# EAGLE design TFT Touch (EAGLE 6.1)
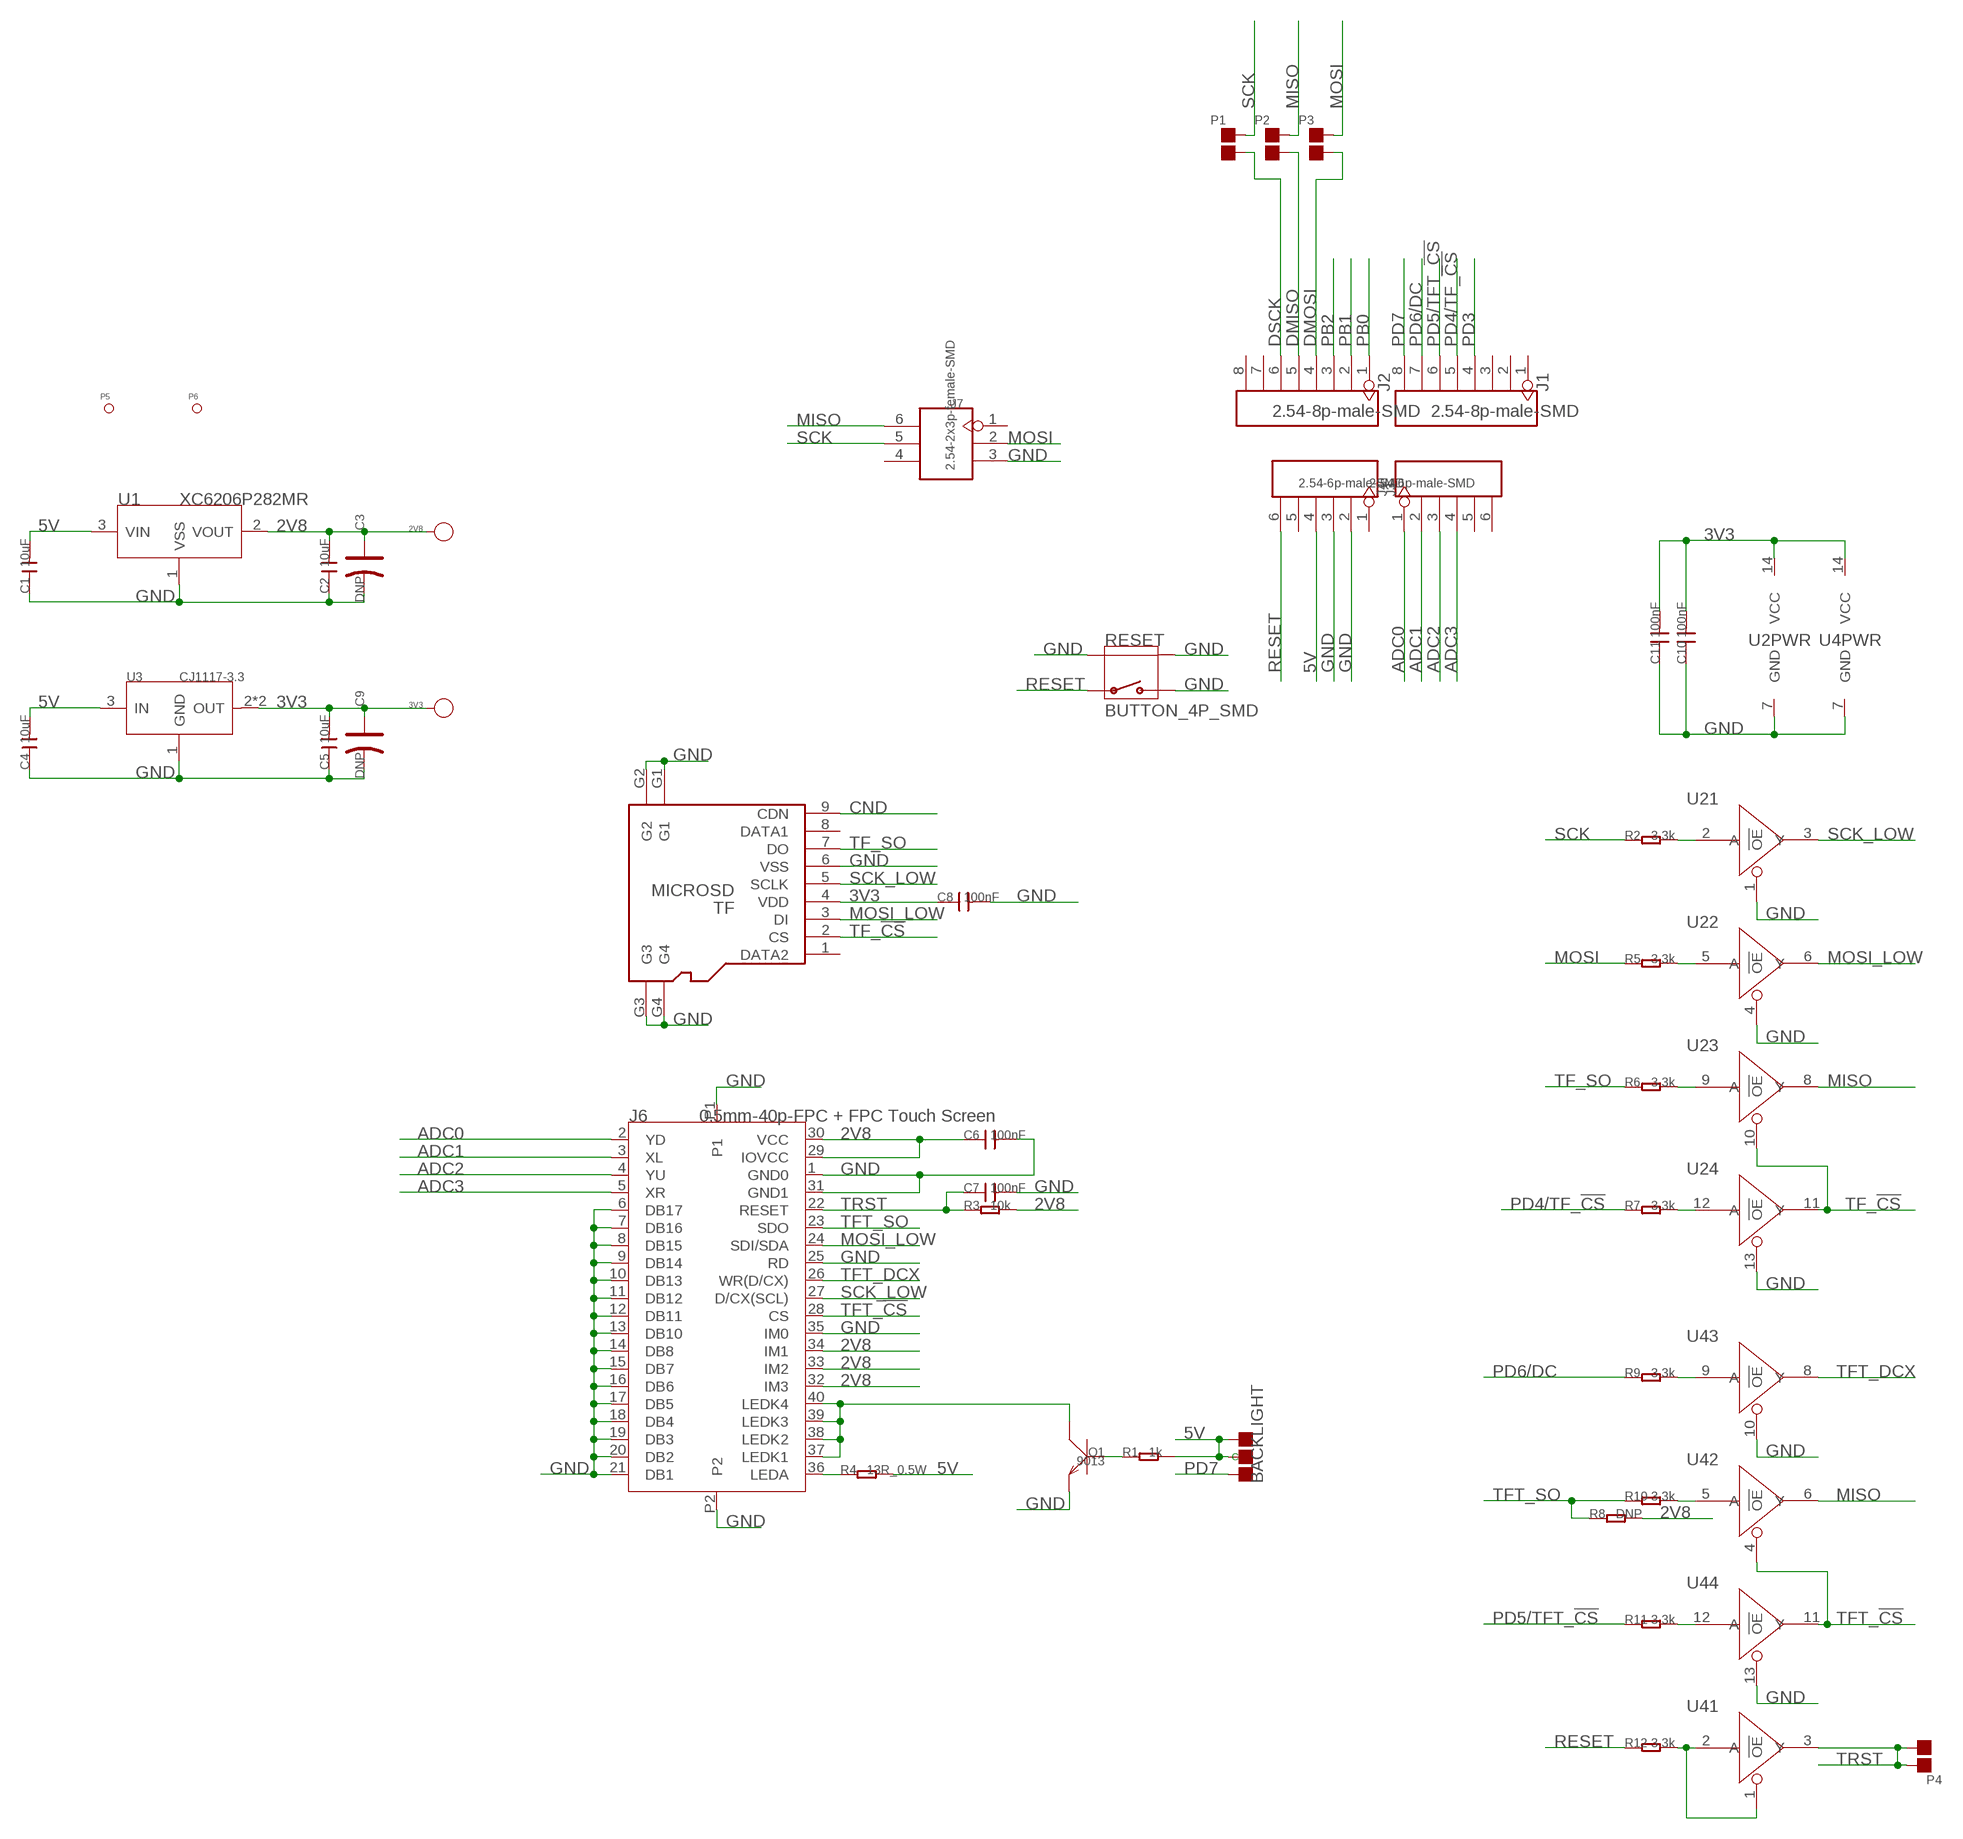
[diagram p0: schematic, sheet 1]

## Parts
2V8  PAD-TEST-POINT-CIRCLE'4545'  [TP_4545]
3V3  PAD-TEST-POINT-CIRCLE'4545'  [TP_4545]
BACKLIGHT  DNP  PAD-JUMPER-3P-40*40  [3P-SMD-4.1X1.5]
C1  10uF  C-0805  [C0805]
C2  10uF  C-0805  [C0805]
C3  DNP  CAP-AVX-A  [AVX-A]
C4  10uF  C-0805  [C0805]
C5  10uF  C-0805  [C0805]
C6  100nF  006-C35*40  [0603@1]
C7  100nF  006-C35*40  [0603@1]
C8  100nF  006-C35*40  [0603@1]
C9  DNP  CAP-AVX-A  [AVX-A]
C10  100nF  006-C35*40  [0603@1]
C11  100nF  006-C35*40  [0603@1]
J1  2.54-8p-male-SMD  HEADER-8P-2.54-SMD  [8P-2.54-SMD]
J2  2.54-8p-male-SMD  HEADER-8P-2.54-SMD  [8P-2.54-SMD]
J3  2.54-6p-male-SMD  HEADER-6P-SMD  [6P-2.54-SMD]
J4  2.54-6p-male-SMD  HEADER-6P-SMD  [6P-2.54-SMD]
J6  0.5mm-40p-FPC + FPC Touch Screen  2.8TFT_FPC  [2.8TFT_FFC]
J7  2.54-2x3p-female-SMD  HEADER-2X3P-SMD  [2X3P-2.54-SMD]
P1  PAD-JUMPER-2P  [2P-SMD-1.78X1.27]
P2  PAD-JUMPER-2P  [2P-SMD-1.78X1.27]
P3  PAD-JUMPER-2P  [2P-SMD-1.78X1.27]
P4  PAD-JUMPER-2P  [2P-SMD-1.78X1.27]
P5  PAD-MARK  [ROUND-MARK-1.0]
P6  PAD-MARK  [ROUND-MARK-1.0]
Q1  9013  TRANSISTOR-NPN-SOT23  [SOT23]
R1  1k  R-0603  [R0603]
R2  3.3k  R-0603  [R0603]
R3  10k  R-0603  [R0603]
R4  13R_0.5W  R-1206  [R1206]
R5  3.3k  R-0603  [R0603]
R6  3.3k  R-0603  [R0603]
R7  3.3k  R-0603  [R0603]
R8  DNP  R-0603  [R0603]
R9  3.3k  R-0603  [R0603]
R10  3.3k  R-0603  [R0603]
R11  3.3k  R-0603  [R0603]
R12  3.3k  R-0603  [R0603]
RESET  BUTTON_4P_SMD  [4P-SMD-7X3.5X3.5]
TF  MICROSD  [MICROSD]
U1  XC6206P282MR  XC6206MR  [SOT23]
U2  74VHC125PW  [TSSOP14]
U3  CJ1117-3.3  LD1117S  [SOT-223]
U4  74VHC125PW  [TSSOP14]

## Nets
2V8: 2V8.T C2.2 C3.+ C6.1 J6.29(IOVCC) J6.30(VCC) J6.32(IM3) J6.33(IM2) J6.34(IM1) R3.2 R8.2 U1.2(VOUT)
3V3: 3V3.T C5.2 C8.1 C9.+ C10.2 C11.2 TF.4(VDD) U2.14(PWR:VCC) U3.2(OUT) U3.TER(OUT) U4.14(PWR:VCC)
5V: BACKLIGHT.00(L) BACKLIGHT.MM(C) C1.2 C4.2 J4.4 R1.2 R4.2 U1.3(VIN) U3.3(IN)
ADC0: J3.1 J6.2(YD)
ADC1: J3.2 J6.3(XL)
ADC2: J3.3 J6.4(YU)
ADC3: J3.4 J6.5(XR)
CND: TF.9(CDN)
DMISO: J2.5 P2.1
DMOSI: J2.4 P3.1
DSCK: J2.6 P1.1
GND: C1.1 C2.1 C3.- C4.1 C5.1 C6.2 C7.2 C8.2 C9.- C10.1 C11.1 J4.2 J4.3 J6.1(GND0) J6.6(DB17) J6.7(DB16) J6.8(DB15) J6.9(DB14) J6.10(DB13) J6.11(DB12) J6.12(DB11) J6.13(DB10) J6.14(DB8) J6.15(DB7) J6.16(DB6) J6.17(DB5) J6.18(DB4) J6.19(DB3) J6.20(DB2) J6.21(DB1) J6.25(RD) J6.31(GND1) J6.35(IM0) J6.P1 J6.P2 J7.3 Q1.2(E) RESET.2 RESET.S1 RESET.S2 TF.6(VSS) TF.G1 TF.G2 TF.G3 TF.G4 U1.1(VSS) U2.1(1:!OE) U2.4(2:!OE) U2.7(PWR:GND) U2.13(4:!OE) U3.1(GND) U4.7(PWR:GND) U4.10(3:!OE) U4.13(4:!OE)
MISO: J7.6 P2.2 U2.8(3:Y) U4.6(2:Y)
MOSI: J7.2 P3.2 R5.1
MOSI_LOW: J6.24(SDI/SDA) TF.3(DI) U2.6(2:Y)
N$2: R2.2 U2.2(1:A)
N$3: Q1.1(B) R1.1
N$4: J6.37(LEDK1) J6.38(LEDK2) J6.39(LEDK3) J6.40(LEDK4) Q1.3(C)
N$5: R5.2 U2.5(2:A)
N$6: R6.2 U2.9(3:A)
N$7: R11.2 U4.12(4:A)
N$8: R10.2 U4.5(2:A)
N$9: J6.36(LEDA) R4.1
N$10: R9.2 U4.9(3:A)
N$15: R7.2 U2.12(4:A)
PB0: J2.1
PB1: J2.2
PB2: J2.3
PD3: J1.4
PD4/TF_!CS: J1.5 R7.1
PD5/TFT_!CS: J1.6 R11.1
PD6/DC: J1.7 R9.1
PD7: BACKLIGHT.11(R) J1.8
RESET: J4.6 R12.1 RESET.1
SCK: J7.5 P1.2 R2.1
SCK_LOW: J6.27(D/CX(SCL)) TF.5(SCLK) U2.3(1:Y)
TF_!CS: TF.2(CS) U2.10(3:!OE) U2.11(4:Y)
TF_SO: R6.1 TF.7(DO)
TFT_!CS: J6.28(CS) U4.4(2:!OE) U4.11(4:Y)
TFT_BUF: R12.2 U4.1(1:!OE) U4.2(1:A)
TFT_DCX: J6.26(WR(D/CX)) U4.8(3:Y)
TFT_SO: J6.23(SDO) R8.1 R10.1
TRST: C7.1 J6.22(RESET) P4.1 P4.2 R3.1 U4.3(1:Y)
Unconnected: J1.1 J1.2 J1.3 J2.7 J2.8 J3.5 J3.6 J4.1 J4.5 J7.1 J7.4 TF.1(DATA2) TF.8(DATA1)

## Library data of the parts
2V8 3V3 = Discrete:PAD-TEST-POINT-CIRCLE; PARTNO: DNP
BACKLIGHT = Discrete:PAD-JUMPER-3P; PARTNO: DNP
C1 C2 C4 C5 = Discrete:C*: Ceramic Capacitors
C3 C9 = Discrete:CAP*: Electrolytic Capacitors,Tantalum Capacitors and Super Capacitors
C6-C8 C10 C11 = Discrete:006-C*: Ceramic Capacitors
J1 J2 = Connector:HEADER-8P
J3 J4 = Connector:HEADER-6P
J6 = For_Test_Albert_v6:2.8TFT_FPC
J7 = Connector:HEADER-2X3P
P1-P4 = Discrete:PAD-JUMPER-2P; PARTNO: DNP
P5 P6 = Discrete:PAD-MARK; PARTNO: DNP
Q1 = Discrete:TRANSISTOR-NPN*: NPN audion
R1-R12 = Discrete:R*
RESET = For_Test_Albert_v6:BUTTON_4P_SMD: TS-1188E http://www.best-dz.com/?thread-374-2.html
TF = SD_TF_holder:MICROSD
U1 = IC:XC6206: LOW ESR Cap.Compatible Positive Voltage Regulators
U2 U4 = template:74V*125: Quad Buffer/Line Driver;3-state
U3 = IC:LD1117: Low Drop Fixed And Adjustable Positive Voltage Regulators http://www.datasheetcatalog.org/datasheet/SGSThomsonMicroelectronics/mXuqtqv.pdf

## Net classes
0 default: width 0.152 mm, drill 0.305 mm, clearance 0.152 mm

## Board
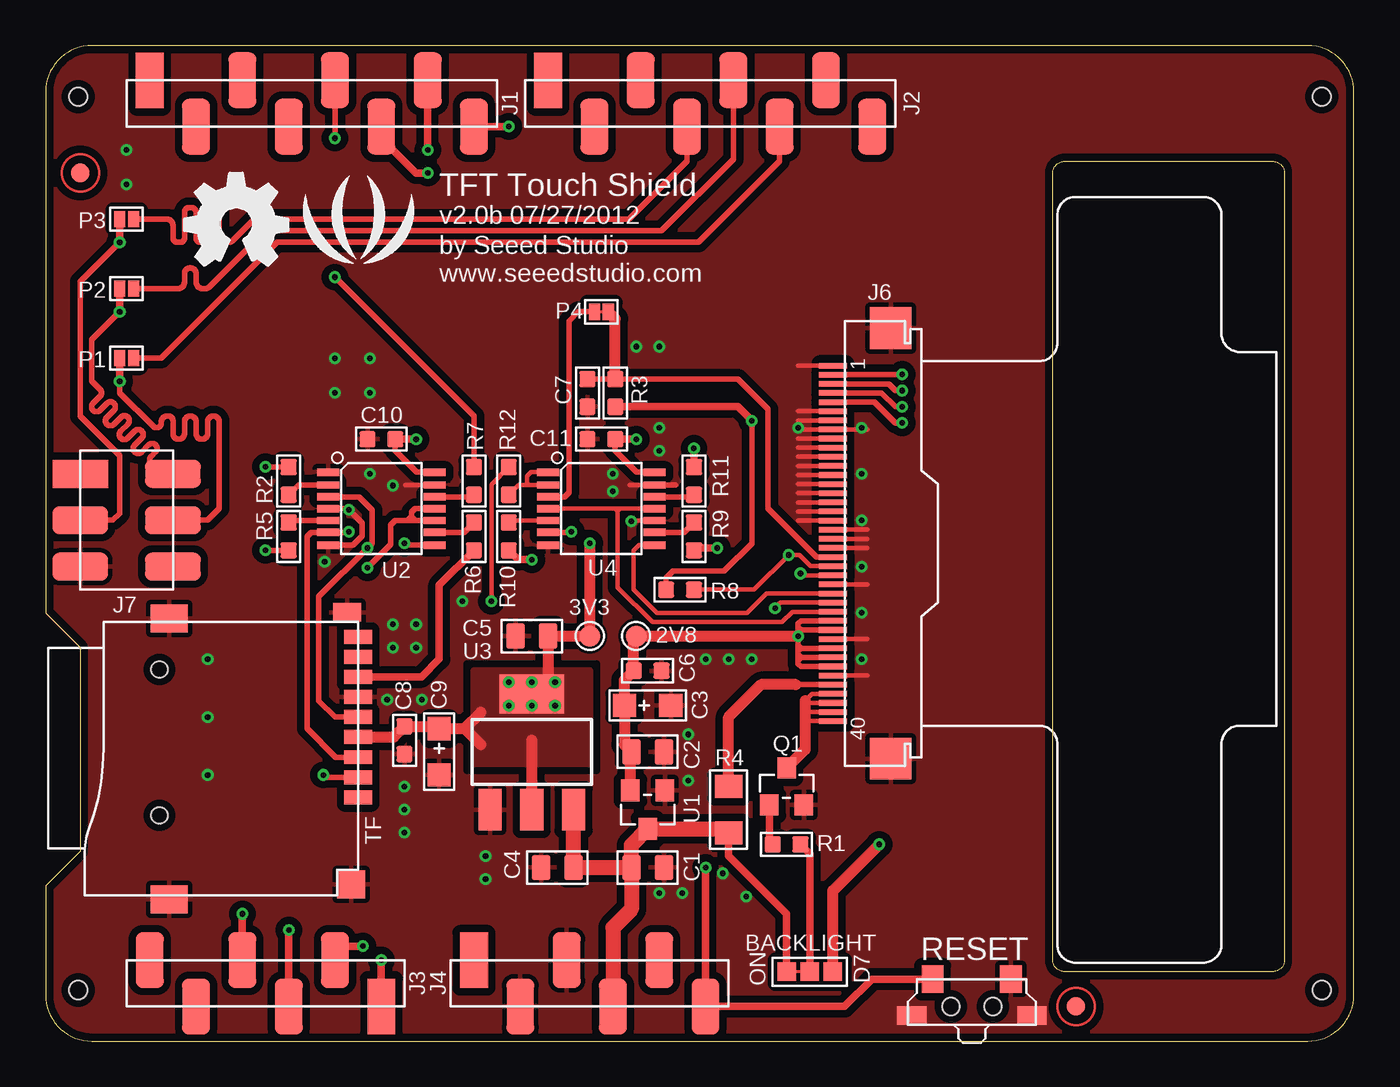
[diagram p1: board, top side]
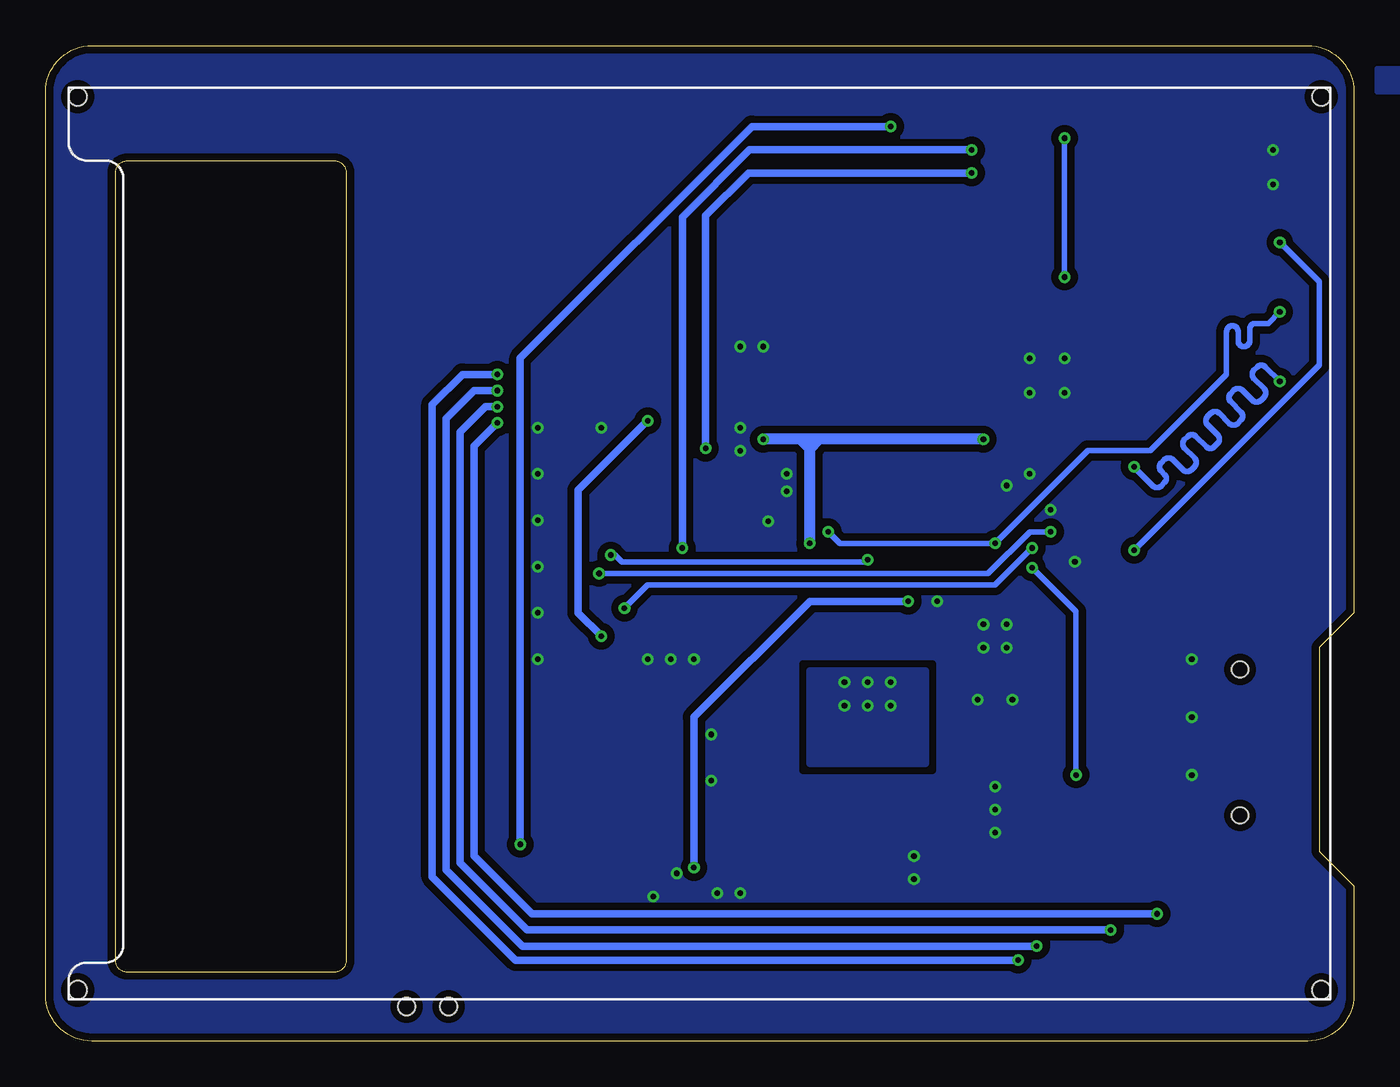
[diagram p2: board, bottom side, seen from below]

Size 71.75 x 54.61 mm. Coordinates in mm from the lower left corner, seen from the top.
Outline: 71.75,52.07 arc90 69.22,54.61 2.54,54.61 arc90 0,52.07 0,23.5 1.91,21.59 1.91,10.41 0,8.51 0,2.54 arc90 2.54,0 69.22,0 arc90 71.75,2.54 71.75,52.07
Outline: 55.88,48.26 67.31,48.26 arc-90 67.94,47.62 67.94,4.45 arc-90 67.31,3.81 55.88,3.81 arc-90 55.25,4.45 55.25,47.62 arc-90 55.88,48.26
Copper layers (1*16): Top 0.035mm / dielectric 1.5mm / Bottom 0.035mm
Design rules: minimum track width 6mil, minimum drill 12mil, track to track 6mil, track to pad 6mil, pad to pad 6mil, via to via 8mil, smd to smd 0mil, copper to edge 10mil, drill to drill 10mil, minimum pad ring 10mil, minimum via ring 6mil, stop-mask expansion 2mil, vias tented up to drill 25mil, thermal gap 10mil
tRestrict: area 42.4,17.4 to 43.9,37.2
Milling: area 55.2,3.8 to 67.9,48.3

### Footprints (pad centres in the part's own frame; a part is rotated, then mirrored left to right if it is on the bottom)
TP_4545 = smd 1.143 x 1.143: T 0,0
3P-SMD-4.1X1.5 = smd 1.016 x 1.016: 00 -1.27,0; 11 1.27,0; MM 0,0
C0805 = smd 1.016 x 1.397: 1 -0.889,0; 2 0.889,0
AVX-A = smd 1.27 x 1.27: + -1.27,0; - 1.27,0
0603@1 = smd 0.889 x 0.889: 1 -0.762,0; 2 0.762,0
8P-2.54-SMD = smd 3.048 x 1.524: 1 1.27,8.89; 2 -1.27,6.35; 3 1.27,3.81; 4 -1.27,1.27; 5 1.27,-1.27; 6 -1.27,-3.81; 7 1.27,-6.35; 8 -1.27,-8.89
6P-2.54-SMD = smd 3.048 x 1.524: 1 1.27,6.35; 2 -1.27,3.81; 3 1.27,1.27; 4 -1.27,-1.27; 5 1.27,-3.81; 6 -1.27,-6.35
2.8TFT_FFC = smd 0.305 x 1.524 bottom: 1 -9.75,3.81; 2 -9.25,3.81; 3 -8.75,3.81; 4 -8.25,3.81; 5 -7.75,3.81; 6 -7.25,3.81; 7 -6.75,3.81; 8 -6.25,3.81; 9 -5.75,3.81; 10 -5.25,3.81; 11 -4.75,3.81; 12 -4.25,3.81; 13 -3.75,3.81; 14 -3.25,3.81; 15 -2.75,3.81; 16 -2.25,3.81; 17 -1.75,3.81; 18 -1.25,3.81; 19 -0.75,3.81; 20 -0.25,3.81; 21 0.25,3.81; 22 0.75,3.81; 23 1.25,3.81; 24 1.75,3.81; 25 2.25,3.81; 26 2.75,3.81; 27 3.25,3.81; 28 3.75,3.81; 29 4.25,3.81; 30 4.75,3.81; 31 5.25,3.81; 32 5.75,3.81; 33 6.25,3.81; 34 6.75,3.81; 35 7.25,3.81; 36 7.75,3.81; 37 8.25,3.81; 38 8.75,3.81; 39 9.25,3.81; 40 9.75,3.81 | smd 2.286 x 2.286 bottom: P1 -11.811,0.635; P2 11.811,0.635 | hole 1: -24.5,45.2; -24.5,-23; 24.5,-23; 24.5,45.2
2X3P-2.54-SMD = smd 3.048 x 1.524: 1 -2.54,2.54; 2 -2.54,0; 3 -2.54,-2.54; 4 2.54,-2.54; 5 2.54,0; 6 2.54,2.54
2P-SMD-1.78X1.27 = smd 0.889 x 0.61: 1 0,0.381; 2 0,-0.381
ROUND-MARK-1.0 = smd 1.016 x 1.016: P$1 0,0
SOT23 = smd 1.016 x 1.143: 1 -0.95,-1.016; 2 0.95,-1.016; 3 0,1.016
R0603 = smd 0.889 x 0.889: 1 -0.762,0; 2 0.762,0
R1206 = smd 1.27 x 1.524: 1 -1.27,0; 2 1.27,0
4P-SMD-7X3.5X3.5 = smd 1.2 x 1.5: 1 -2.15,1.5; 2 2.15,1.5 | smd 1.6 x 1: S1 -3.3,-0.5; S2 3.3,-0.5 | hole 0.95: -1.15,0; 1.15,0
MICROSD = smd 1.524 x 0.762: 1 0,4.4; 2 0,3.3; 3 0,2.2; 4 0,1.1; 5 0,0; 6 0,-1.1; 7 0,-2.2; 8 0,-3.3; 9 0,-4.4 | smd 1.524 x 1.016: G1 0.6,-5.746 | smd 2.032 x 1.524: G2 10.373,-5.4; G3 10.373,10 | smd 1.524 x 1.524: G4 0.392,9.181 | hole 0.889: 10.9,-2.6; 10.9,5.4
SOT23' = smd 1.016 x 1.2: 1 -0.95,-1.06; 2 0.95,-1.06; 3 0,1.06
TSSOP14 = smd 0.4 x 1.2: 1 -2,-2.925; 2 -1.3,-2.925; 3 -0.65,-2.925; 4 0,-2.925; 5 0.65,-2.925; 6 1.3,-2.925; 7 2,-2.925; 8 2,2.925; 9 1.3,2.925; 10 0.65,2.925; 11 0,2.925; 12 -0.65,2.925; 13 -1.3,2.925; 14 -2,2.925
SOT-223 = smd 1.27 x 2.286: 1 -2.286,-3.175; 2 0,-3.175; 3 2.286,-3.175 | smd 3.556 x 2.159: TER 0,3.175

### Placement (x,y rotation side)
2V8  32.39,22.23 0 top
3V3  29.85,22.23 0 top
BACKLIGHT  41.91,3.81 0 top
C1  33.02,9.52 180 top
C2  33.02,15.88 180 top
C3  33.02,18.41 0 top
C4  28.07,9.52 0 top
C5  26.67,22.23 0 top
C6  33.02,20.32 0 top
C7  29.72,35.56 270 top
C8  19.69,16.51 270 top
C9  21.59,15.88 270 top
C10  18.42,33.02 0 top
C11  30.48,33.02 0 top
J1  14.61,51.44 90 top
J2  36.45,51.44 90 top
J3  12.07,3.18 270 top
J4  29.85,3.18 90 top
J6  46.99,27.3 270 bottom
J7  4.45,28.57 0 top
P1  4.45,37.47 270 top
P2  4.45,41.27 270 top
P3  4.45,45.09 270 top
P4  30.48,40 90 top
P5  56.52,1.91 0 top
P6  1.91,47.62 0 top
Q1  40.64,13.97 0 top
R1  40.64,10.79 0 top
R2  13.34,30.73 270 top
R3  31.24,35.56 270 top
R4  37.47,12.7 270 top
R5  13.34,27.69 90 top
R6  23.5,27.69 90 top
R7  23.5,30.73 270 top
R8  34.8,24.77 180 top
R9  35.56,27.69 90 top
R10  25.4,27.69 90 top
R11  35.56,30.73 270 top
R12  25.4,30.73 270 top
RESET  50.8,1.91 0 top
TF  17.15,17.78 180 top
U1  XC6206P282MR  [SOT23']  33.02,12.7 180 top
U2  18.42,29.21 270 top
U3  26.67,15.88 0 top
U4  30.48,29.21 270 top
U$1  [OSHW_FILLX200_NOTEXT]  7.62,42.55 0 top
U$2  [LOGO_SILK]  17.15,44.32 0 top

### Tracks (layer width: path | path; a pad name or v marks a point on that pad's centre or on a via)
2V8  (via drill 0.3 pad 0.64)
  Top 0.305: J6.34 41.42,20.55 41.28,20.7 41.28,20.89 | 41.28,21.08 41.28,21.21 | 41.28,21.21 41.28,21.4 | 41.28,21.4 41.28,21.59 | 41.28,21.59 41.28,21.72 | 41.28,21.72 v41.28,22.23 | 41.28,22.42 41.28,22.73 | 41.28,22.73 41.28,22.91 41.42,23.05 J6.29 | J6.30 41.45,22.55 | 41.45,22.55 41.41,22.55 41.28,22.42 | J6.32 41.44,21.55 | 41.43,21.55 41.31,21.55 41.28,21.59 | J6.33 41.44,21.05 | 41.43,21.05 41.3,21.05 41.28,21.08 | 41.28,21.08 41.28,20.89 | v41.28,22.23 41.28,22.42 | 41.44,21.55 41.28,21.72 | 41.44,21.55 41.43,21.55 | 41.43,21.55 41.28,21.4 | 41.44,21.05 41.43,21.05 | 41.43,21.05 41.28,21.21 | v41.28,22.23 41.28,22.35 41.47,22.54 | 41.45,22.55 41.28,22.73 | 41.44,21.05 41.28,20.89 | R8.2 34.04,25.4 34.42,25.78 37.21,25.78 38.73,27.3 v38.73,34.04
  Top 0.406: R3.2 37.97,34.8 v38.73,34.04
  Top 0.61: U1.2 32.07,15.81 C2.2 31.75,16.26 C3.+ 31.75,19.81 C6.1 32.26,22.1 2V8.T v41.28,22.23
  Bottom 0.406: v41.28,22.23 42.55,23.5 42.55,30.23 v38.73,34.04
3V3  (via drill 0.3 pad 0.64)
  Top 0.305: U4.14 32.42,31.21 31.24,32.38 C11.2 | U2.14 20.35,31.21 19.18,32.38 C10.2
  Top 0.406: v32.39,33.02 C11.2 | C10.2 v20.32,33.02
  Top 0.61: 22.99,17.14 23.88,18.03 | 23.88,16.26 22.99,17.14 | U3.2 26.67,16.51 | TF.4 19.09,16.68 C8.1 21.46,17.27 C9.+ 22.99,17.14 | v27.94,19.68 27.56,20.07 C5.2 3V3.T v29.85,27.3
  Bottom 0.61: v20.32,33.02 29.34,33.02 | 29.34,33.02 30.35,33.02 | 30.35,33.02 v32.39,33.02 | v29.85,27.3 29.85,32.51 | 29.85,32.51 29.34,33.02 | 30.35,33.02 29.85,32.51
  other vias: 26.67,19.68 25.4,19.68 27.94,18.41 25.4,18.41 26.67,18.41
  pour Top (isolate 0.406, no thermals): 23.5,20.32 29.85,20.32 29.85,15.24 23.5,15.24
  pour Bottom (isolate 0.406, no thermals): 23.5,20.32 29.85,20.32 29.85,15.24 23.5,15.24
5V
  Top 0.152: BACKLIGHT.MM BACKLIGHT.00
  Top 0.406: BACKLIGHT.00 40.64,6.98 37.47,10.16 R4.2 | BACKLIGHT.MM 41.91,10.29 R1.2
  Top 0.813: U3.3 C4.2 C1.2 | C1.2 32.13,10.75 U1.3 37.26,11.64 R4.2 | C1.2 32.13,7.24 31.12,6.22 J4.4
ADC0  (via drill 0.3 pad 0.64)
  Top 0.305: J6.2 46.97,36.55 v46.99,36.58
  Top 0.406: J3.1 v18.42,4.45
  Bottom 0.406: v46.99,36.58 48.9,36.58 50.55,34.92 50.55,9.02 45.97,4.45 v18.42,4.45
ADC1  (via drill 0.3 pad 0.64)
  Top 0.305: J6.3 46.24,36.05 46.61,35.69 v46.99,35.69
  Top 0.406: v17.4,5.21 16.26,5.21 15.88,4.83 J3.2
  Bottom 0.406: v46.99,35.69 48.26,35.69 49.78,34.16 49.78,9.4 45.59,5.21 v17.4,5.21
ADC2  (via drill 0.3 pad 0.64)
  Top 0.305: J6.4 45.85,35.55 46.61,34.8 v46.99,34.8
  Top 0.406: v13.34,6.1 J3.3
  Bottom 0.406: v46.99,34.8 47.62,34.8 49.02,33.4 49.02,9.78 45.34,6.1 43.69,6.1 v13.34,6.1
ADC3  (via drill 0.3 pad 0.64)
  Top 0.305: J6.5 45.46,35.05 46.61,33.91 v46.99,33.91
  Top 0.406: J3.4 v10.8,6.98
  Bottom 0.406: v46.99,33.91 48.26,32.64 48.26,10.16 45.09,6.98 20.96,6.98 v10.8,6.98
DMISO
  Top 0.305: P2.1 7.24,41.27 arc90 7.62,41.66 7.62,42.1 arc-90 7.94,42.42 arc-90 8.26,42.1 8.26,41.66 arc90 8.64,41.27 8.73,41.27 arc45 9,41.39 12.07,44.45 33.78,44.45 37.72,48.39 J2.5
DMOSI
  Top 0.305: P3.1 6.67,45.09 arc-90 6.98,44.77 6.98,44.07 arc90 7.24,43.81 7.37,43.81 arc90 7.62,44.07 7.62,45.47 arc-90 7.87,45.72 8,45.72 arc-90 8.26,45.47 8.26,44.07 arc90 8.51,43.81 8.64,43.81 arc90 8.89,44.07 8.89,45.47 arc-90 9.14,45.72 9.27,45.72 arc-90 9.52,45.47 9.52,44.07 arc90 9.78,43.81 10.05,43.81 arc45 10.23,43.89 11.43,45.09 32,45.09 35.18,48.26 J2.4
DSCK
  Top 0.305: P1.1 6.35,37.47 12.7,43.81 35.81,43.81 40.26,48.26 J2.6
GND  (via drill 0.3 pad 0.64)
  Top 0.254: U4.10 32.18,28.56 v32.13,28.51 | U4.13 32.04,30.51 | J6.1 41.28,37.05 | J6.6 41.28,34.55 | J6.7 41.28,34.05 | 41.28,33.55 J6.8 45.09,33.55 | J6.9 41.28,33.05 | J6.10 41.28,32.55 | J6.11 41.28,32.05 | J6.12 41.28,31.55 | J6.13 41.28,31.05 | J6.14 41.28,30.55 | J6.15 41.28,30.05 | J6.16 41.28,29.55 | J6.17 41.28,29.05 | J6.18 41.28,28.55 | J6.35 45.09,20.05 | U2.13 19.72,30.51 | J6.21 45.09,27.05 | J6.20 45.09,27.55 | J6.19 45.09,28.05 | J6.25 45.09,25.05 | J6.31 45.09,22.05
  Top 0.305: U2.4 16.57,29.21 v16.64,29.15 17.36,28.43 17.36,27.71 16.86,27.21 U2.7 | U4.13 34.54,30.51
  other vias: 15.3,26.29 8.89,20.95 4.45,48.89 8.89,17.78 8.89,14.61 19.69,12.7 19.69,13.97 19.05,22.86 19.05,21.59 20.32,22.86 22.86,24.13 32.39,38.1 33.66,32.38 15.88,35.56 17.78,35.56 17.78,37.47 15.88,37.47 19.05,30.48 17.78,31.11 37.47,20.95 31.12,31.11 33.66,33.66 20.32,21.59 24.13,8.89 24.13,10.16 33.66,8.13 19.69,11.43 34.93,8.13 36.2,20.95 38.73,20.95 33.66,38.1 37.15,9.21 38.42,7.94 35.24,16.83 44.77,26.04 44.77,33.66 31.12,30.16 41.28,33.66 4.45,46.99 44.77,31.11 44.77,28.57 44.77,23.5 44.77,20.95 35.24,14.29 18.73,18.73 20.64,18.73
  pour Bottom: -2.54,53.34 -1.27,53.34 -1.27,52.07 -2.54,52.07
  pour Top (isolate 0.406, rank 6, no thermals): 45.72,2.29 55.88,2.29 55.88,0 45.72,0
  pour Top (isolate 0.406, rank 6): 0,54.61 71.75,54.61 71.75,0 0,0
  pour Bottom (isolate 0.406, rank 6): 0,54.61 71.75,54.61 71.75,0 0,0
MISO  (via drill 0.3 pad 0.64)
  Top 0.305: U2.8 19.78,27.21 v19.69,27.3 | v4.06,40 2.54,38.48 2.54,36.2 3,35.74 arc-90 3,35.38 2.59,34.98 arc90 2.59,34.62 2.61,34.6 arc90 2.97,34.6 3.38,35 arc-90 3.74,35 3.76,34.98 arc-90 3.76,34.62 3.36,34.22 arc90 3.36,33.86 3.38,33.84 arc90 3.74,33.84 4.14,34.24 arc-90 4.5,34.24 4.52,34.22 arc-90 4.52,33.86 4.12,33.45 arc90 4.12,33.09 4.14,33.07 arc90 4.5,33.07 4.9,33.48 arc-90 5.26,33.48 5.28,33.45 arc-90 5.28,33.09 4.88,32.69 arc90 4.88,32.33 4.9,32.31 arc90 5.26,32.31 5.66,32.71 arc-90 6.02,32.71 6.04,32.69 arc-90 6.04,32.33 5.79,32.08 arc45 5.72,31.9 5.72,31.86 arc45 5.79,31.68 6.35,31.11 J7.6 | U4.6 28.8,27.91 v28.83,27.94
  Top 0.406: P2.2 v4.06,40
  Bottom 0.305: v4.06,40 4.7,39.37 5.4,39.37 arc-90 5.72,39.05 5.72,38.42 arc90 6.03,38.1 arc90 6.35,38.42 6.35,38.92 arc-90 6.67,39.24 arc-90 6.98,38.92 6.98,36.58 11.18,32.38 14.61,32.38 v19.69,27.3 28.19,27.3 v28.83,27.94
MOSI  (via drill 0.3 pad 0.64)
  Top 0.305: J7.2 3.68,28.57 4.06,28.96 4.06,32.13 1.91,34.29 1.91,41.66 v4.06,43.81 | R5.1 v12.07,26.92
  Top 0.406: P3.2 v4.06,43.81
  Bottom 0.305: v12.07,26.92 1.91,37.08 1.91,41.66 v4.06,43.81
MOSI_LOW  (via drill 0.3 pad 0.64)
  Top 0.254: 41.5,25.55 v41.4,25.65 41.5,25.55 | J6.24 41.5,25.55
  Top 0.305: TF.3 15.92,15.58 14.35,17.14 14.35,27.69 14.58,27.91 U2.6 16.61,27.91 v16.64,27.94
  Bottom 0.305: v16.64,27.94 17.78,27.94 20.07,25.65 v41.4,25.65
N$2
  Top 0.305: U2.2 13.87,30.51 R2.2
N$3
  Top 0.406: Q1.1 39.69,10.98 R1.1
N$4
  Top 0.254: J6.37 42.04,19.05 41.66,18.67 | J6.38 41.67,18.55 41.66,18.54 | J6.39 41.68,18.05 41.66,18.03 | J6.40 41.69,17.55 41.66,17.53
  Top 0.61: 41.66,18.67 41.66,18.54 41.66,18.03 41.66,17.53 41.66,16 Q1.3
N$5
  Top 0.305: U2.5 13.45,28.56 R5.2
N$6
  Top 0.305: U2.9 22.96,27.91 R6.2
N$7
  Top 0.305: U4.12 35.45,29.86 R11.2
N$8
  Top 0.254: U4.5 25.51,28.56 R10.2
N$9
  Top 0.305: J6.36 41.15,19.55
  Top 0.61: R4.1 37.47,17.78 39.24,19.55 41.15,19.55
N$10
  Top 0.305: U4.9 35.02,27.91 R9.2
N$15
  Top 0.305: U2.12 23.38,29.86 R7.2
PD4/TF_!CS  (via drill 0.3 pad 0.64)
  Top 0.305: v15.88,49.53 J1.5 | R7.1 23.5,34.29 v15.88,41.91
  Bottom 0.305: v15.88,41.91 v15.88,49.53
PD5/TFT_!CS  (via drill 0.3 pad 0.64)
  Top 0.406: J1.6 18.42,49.53 20.32,47.62 v20.96,47.62 | R11.1 v35.56,32.51
  Bottom 0.406: v20.96,47.62 33.22,47.62 35.56,45.28 v35.56,32.51
PD6/DC  (via drill 0.3 pad 0.64)
  Top 0.406: v20.96,48.89 J1.7 | v36.83,27.05 35.69,27.05 R9.1
  Bottom 0.406: v36.83,27.05 36.83,45.21 33.15,48.89 v20.96,48.89
PD7  (via drill 0.3 pad 0.64)
  Top 0.406: v25.4,50.16 J1.8
  Top 0.61: BACKLIGHT.11 43.18,8.25 v45.72,10.79
  Bottom 0.406: v45.72,10.79 45.72,37.47 33.02,50.16 v25.4,50.16
RESET  (via drill 0.3 pad 0.64)
  Top 0.254: v24.45,24.13 24.45,30.54 R12.1
  Top 0.406: v36.2,9.52 J4.6 43.82,1.91 45.32,3.41 RESET.1
  Bottom 0.406: v24.45,24.13 29.85,24.13 36.2,17.78 v36.2,9.52
SCK  (via drill 0.3 pad 0.64)
  Top 0.305: J7.5 8.89,28.57 9.52,29.21 9.52,33.97 arc90 9.21,34.29 arc90 8.89,33.97 8.89,33.34 arc-90 8.57,33.02 arc-90 8.26,33.34 8.26,33.97 arc90 7.94,34.29 arc90 7.62,33.97 7.62,33.34 arc-90 7.3,33.02 arc-90 6.98,33.34 6.98,34.04 arc90 6.73,34.29 6.67,34.29 arc90 6.35,33.97 6.35,33.91 arc-90 6.1,33.66 6.07,33.66 arc-45 5.9,33.73 4.06,35.56 v4.06,36.2 | R2.1 v12.07,31.5
  Top 0.406: P1.2 v4.06,36.2
  Bottom 0.305: v12.07,31.5 11.02,30.45 arc-90 10.57,30.45 10.39,30.64 arc-90 10.39,31.09 10.57,31.27 arc90 10.57,31.72 10.39,31.91 arc90 9.94,31.91 9.37,31.34 arc-90 8.92,31.34 8.73,31.52 arc-90 8.73,31.98 9.3,32.54 arc90 9.3,32.99 9.12,33.18 arc90 8.66,33.18 8.1,32.61 arc-90 7.65,32.61 7.46,32.8 arc-90 7.46,33.24 8.03,33.81 arc90 8.03,34.26 7.84,34.45 arc90 7.4,34.45 6.83,33.88 arc-90 6.38,33.88 6.19,34.06 arc-90 6.19,34.52 6.76,35.08 arc90 6.76,35.53 6.58,35.72 arc90 6.12,35.72 5.56,35.15 arc-90 5.11,35.15 4.92,35.34 arc-90 4.92,35.78 5.49,36.35 arc90 5.49,36.8 5.3,36.99 arc90 4.86,36.99 v4.06,36.2
SCK_LOW  (via drill 0.3 pad 0.64)
  Top 0.254: J6.27 40.31,24.05 v40.01,23.75
  Top 0.305: TF.5 15.88,17.78 14.99,18.67 14.99,24.38 v17.65,27.05 17.91,27.3 17.91,29.15 17.19,29.86 U2.3
  Bottom 0.305: v17.65,27.05 19.69,25.02 38.73,25.02 v40.01,23.75
TF_!CS  (via drill 0.3 pad 0.64)
  Top 0.305: 20.07,28.77 20.07,28.75 20.26,28.56 | 20.26,28.56 U2.10 | U2.11 20.26,29.21 20.07,29.02 20.07,28.77 | TF.2 15.37,14.48 v15.24,14.61 | 20.26,28.56 19.16,28.56 18.92,28.32 18.92,27.24 v17.65,25.97 | 20.07,28.77 19.88,28.57
  Bottom 0.305: v15.24,14.61 15.24,23.56 v17.65,25.97
TF_SO
  Top 0.406: TF.7 20.62,19.98 21.59,20.95 21.59,25.02 R6.1
TFT_!CS
  Top 0.254: U4.4 31.24,29.21 | 31.24,29.21 31.37,29.21 | 31.37,29.21 31.5,29.21 | 31.5,29.21 U4.11 | 31.37,29.21 31.37,24.89 33.27,22.99 40.39,22.99 40.95,23.55 J6.28 | 31.24,29.21 31.37,29.08 31.5,29.21
TFT_BUF
  Top 0.254: U4.2 26.51,30.51 | 26.51,30.51 26.32,30.51 | R12.2 25.94,30.51 26.32,30.51 | U4.1 26.64,31.21 26.42,30.99 26.42,30.61 | 26.42,30.61 26.42,30.54 | 26.51,30.51 26.42,30.61 | 26.32,30.51 26.42,30.61
TFT_DCX
  Top 0.254: J6.26 39.54,24.55 38.48,23.5 33.53,23.5 32.26,24.77 32.26,26.92 32.54,27.21 U4.8
TFT_SO  (via drill 0.3 pad 0.64)
  Top 0.254: J6.23 41.95,26.05 41.34,26.67 v40.77,26.67 38.86,24.77 R8.1
  Top 0.406: v26.67,26.42 25.91,26.42 R10.1
  Bottom 0.305: v26.67,26.42 26.8,26.29 40.13,26.29 40.51,26.67 v40.77,26.67
TRST
  Top 0.152: P4.1 P4.2
  Top 0.305: J6.22 42.28,26.55 39.62,29.21 39.62,34.67 37.97,36.32 R3.1 C7.1 | U4.3 28.46,29.86 28.7,30.1 28.7,39.5 29.21,40 P4.1
  Top 0.61: R3.1 31.24,39.62 P4.2

### Text on the board
tPlace: TFT Touch Shield | v2.0b 07/27/2012 | by Seeed Studio | www.seeedstudio.com | ON | D7